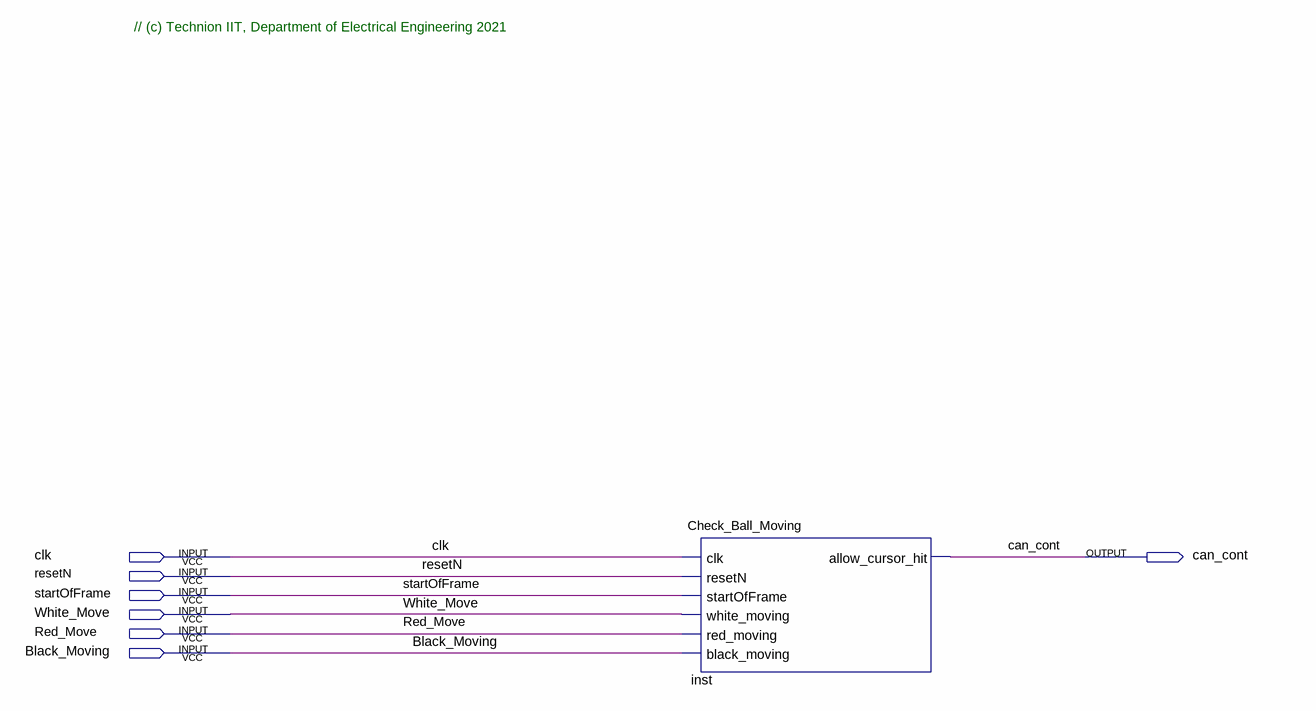
[diagram p0: schematic sheet]
// Quartus schematic Check_Balls_Moving_block.bdf as structural Verilog: 1 symbols, 7 pins
module Check_Balls_Moving_block (
  input  clk,
  input  resetN,
  input  startOfFrame,
  input  White_Move,
  input  Red_Move,
  input  Black_Moving,
  output can_cont
);

  Check_Ball_Moving inst (
    .clk(clk), .resetN(resetN), .startOfFrame(startOfFrame), .white_moving(White_Move),
    .red_moving(Red_Move), .black_moving(Black_Moving), .allow_cursor_hit(can_cont));

  // Notes on the sheet:
  //   // (c) Technion IIT, Department of Electrical Engineering 2021
endmodule
